# Altium schematic sheet HV_power.SchDoc
size A4; SheetNumber: 5; SheetTotal: 6
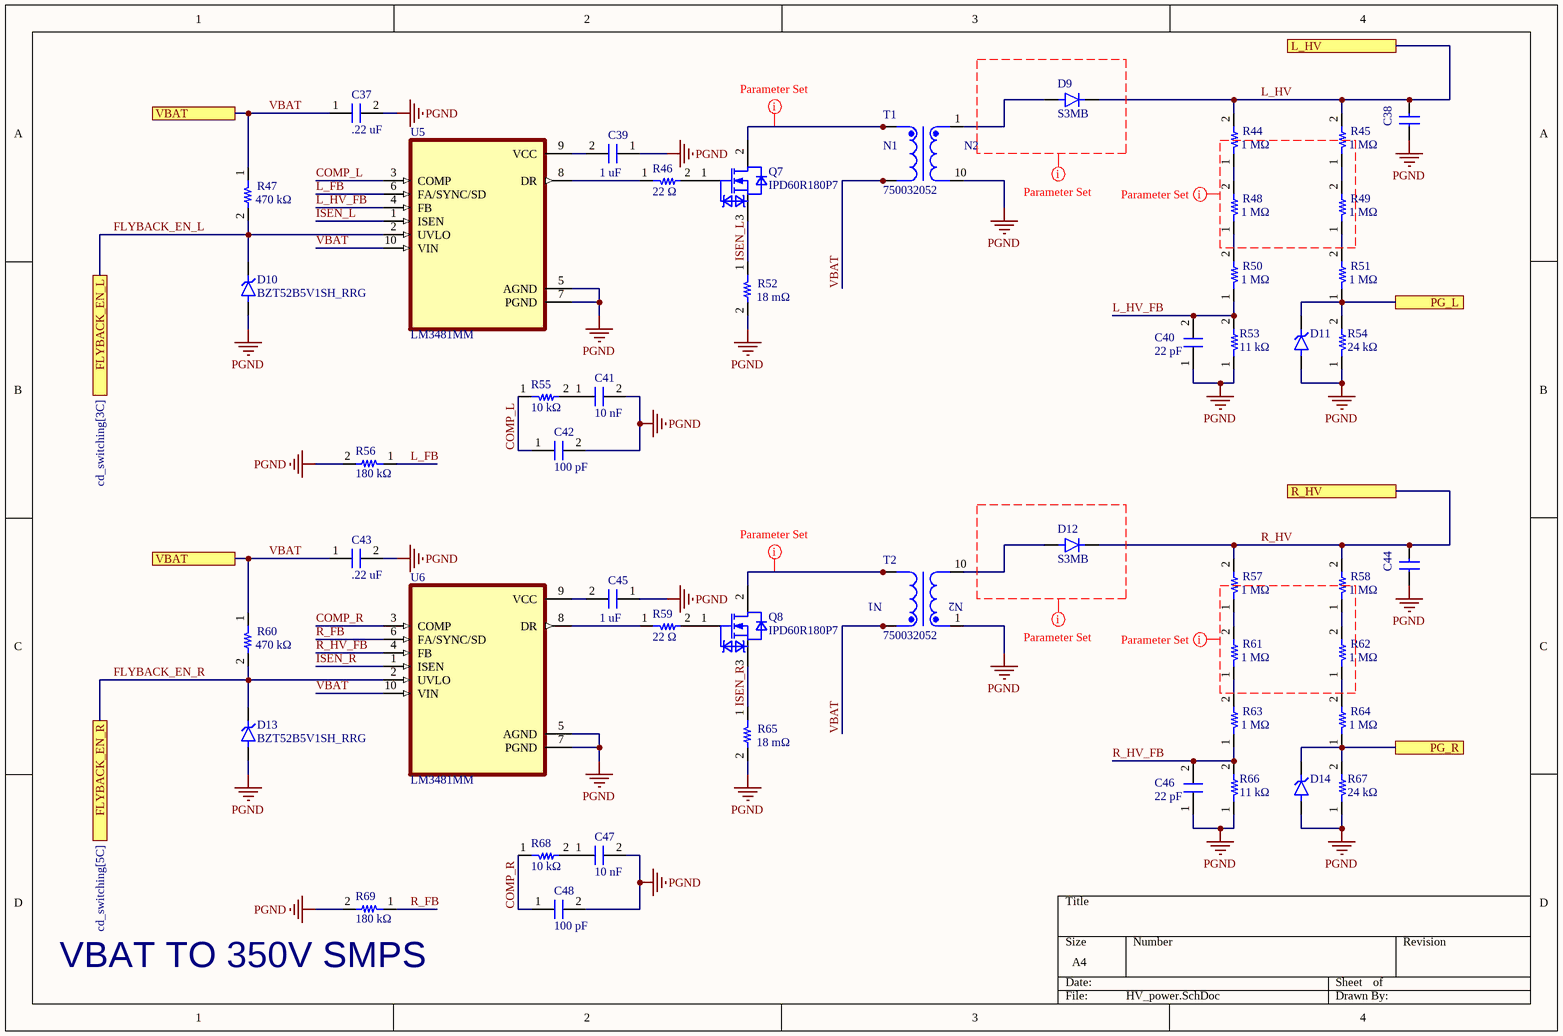
[diagram p0: HV_power.SchDoc]

## Parts
C37  value .22 uF  [0603_FP]  (hidden comment: GRM21BR61C475KA88L)
C38  WCAP-FTBP_P10  [WCAP-FTBP_10X13X5.5X11(PXLXWXH)]  (value not drawn)
C39  value 1 uF  [0603_FP]  (hidden comment: Capacitor_0603)
C40  value 22 pF  [0603_FP]  (hidden comment: Capacitor_0603)
C41  value 10 nF  [0603_FP]  (hidden comment: Capacitor_0603)
C42  value 100 pF  [0603_FP]  (hidden comment: Capacitor_0603)
C43  value .22 uF  [0603_FP]  (hidden comment: GRM21BR61C475KA88L)
C44  WCAP-FTBP_P10  [WCAP-FTBP_10X13X5.5X11(PXLXWXH)]  (value not drawn)
C45  value 1 uF  [0603_FP]  (hidden comment: Capacitor_0603)
C46  value 22 pF  [0603_FP]  (hidden comment: Capacitor_0603)
C47  value 10 nF  [0603_FP]  (hidden comment: Capacitor_0603)
C48  value 100 pF  [0603_FP]  (hidden comment: Capacitor_0603)
D9  S3MB  [DIOM4336X265N]
D10  BZT52B5V1SH_RRG  [DIO_BZT52B5V1SH_RRG]
D11  BZT52B15SH_RRG  [DIO_BZT52B15SH_RRG]  (value not drawn)
D12  S3MB  [DIOM4336X265N]
D13  BZT52B5V1SH_RRG  [DIO_BZT52B5V1SH_RRG]
D14  BZT52B15SH_RRG  [DIO_BZT52B15SH_RRG]  (value not drawn)
Q7  IPD60R180P7  [DPAK228P987X240-3N]
Q8  IPD60R180P7  [DPAK228P987X240-3N]
R44  value 1 MΩ  [0805_FP]  (hidden comment: R_0805)
R45  value 1 MΩ  [0805_FP]  (hidden comment: R_0805)
R46  value 22 Ω  [0603_FP]  (hidden comment: Resistor_0603)
R47  value 470 kΩ  [0603_FP]  (hidden comment: Resistor_0603)
R48  value 1 MΩ  [0805_FP]  (hidden comment: R_0805)
R49  value 1 MΩ  [0805_FP]  (hidden comment: R_0805)
R50  value 1 MΩ  [0805_FP]  (hidden comment: R_0805)
R51  value 1 MΩ  [0805_FP]  (hidden comment: R_0805)
R52  value 18 mΩ  [2010_FP]  (hidden comment: 2010_res)
R53  value 11 kΩ  [0805_FP]  (hidden comment: R_0805)
R54  value 24 kΩ  [0805_FP]  (hidden comment: R_0805)
R55  value 10 kΩ  [0603_FP]  (hidden comment: Resistor_0603)
R56  value 180 kΩ  [0603_FP]  (hidden comment: Resistor_0603)
R57  value 1 MΩ  [0805_FP]  (hidden comment: R_0805)
R58  value 1 MΩ  [0805_FP]  (hidden comment: R_0805)
R59  value 22 Ω  [0603_FP]  (hidden comment: Resistor_0603)
R60  value 470 kΩ  [0603_FP]  (hidden comment: Resistor_0603)
R61  value 1 MΩ  [0805_FP]  (hidden comment: R_0805)
R62  value 1 MΩ  [0805_FP]  (hidden comment: R_0805)
R63  value 1 MΩ  [0805_FP]  (hidden comment: R_0805)
R64  value 1 MΩ  [0805_FP]  (hidden comment: R_0805)
R65  value 18 mΩ  [2010_FP]  (hidden comment: 2010_res)
R66  value 11 kΩ  [0805_FP]  (hidden comment: R_0805)
R67  value 24 kΩ  [0805_FP]  (hidden comment: R_0805)
R68  value 10 kΩ  [0603_FP]  (hidden comment: Resistor_0603)
R69  value 180 kΩ  [0603_FP]  (hidden comment: Resistor_0603)
T1  750032052  [WE-FB3751_EFD20]
T2  750032052  [WE-FB3751_EFD20]
U5  LM3481MM  [SOP50P490X110-10N]
U6  LM3481MM  [SOP50P490X110-10N]

## Ports
FLYBACK_EN_L (see cd_switching[3C]), FLYBACK_EN_R (see cd_switching[5C]), L_HV (see cd_switching[4A]), PG_L (see logic[3B]), PG_R (see logic[3B]), R_HV (see cd_switching[6B]), VBAT (see cd_switching[3A], cd_switching[3B], HV_power[1A], input_output[2D], LV_power[1B]), VBAT (see cd_switching[3A], cd_switching[3B], HV_power[1C], input_output[2D], LV_power[1B])

## Nets
PGND: C37.2 C38.1 C39.1 C40.1 C41.2 C42.2 C43.2 C44.1 C45.1 C46.1 C47.2 C48.2 D10.2(A) D11.2(A) D13.2(A) D14.2(A) R52.2 R53.1 R54.1 R56.2 R65.2 R66.1 R67.1 R69.2 T1.10 T2.1 U5.5(AGND) U5.7(PGND) U6.5(AGND) U6.7(PGND)
COMP_L: C42.1 R55.1 U5.3(COMP)
COMP_R: C48.1 R68.1 U6.3(COMP)
FLYBACK_EN_L: D10.1(K) R47.2 U5.2(UVLO) ; port FLYBACK_EN_L
FLYBACK_EN_R: D13.1(K) R60.2 U6.2(UVLO) ; port FLYBACK_EN_R
ISEN_L: Q7.3(SOURCE) R52.1 U5.1(ISEN)
ISEN_R: Q8.3(SOURCE) R65.1 U6.1(ISEN)
L_FB: R56.1 U5.6(FA/SYNC/SD)
L_HV: C38.2 D9.C(K) R44.2 R45.2 ; port L_HV
L_HV_FB: C40.2 R50.1 R53.2 U5.4(FB)
PG_L: D11.1(K) R51.1 R54.2 ; port PG_L
PG_R: D14.1(K) R64.1 R67.2 ; port PG_R
R_FB: R69.1 U6.6(FA/SYNC/SD)
R_HV: C44.2 D12.C(K) R57.2 R58.2 ; port R_HV
R_HV_FB: C46.2 R63.1 R66.2 U6.4(FB)
VBAT: C37.1 C43.1 R47.1 R60.1 T1.4(4+5) T1.5(4+5) T2.6(6+7) T2.7(6+7) U5.10(VIN) U6.10(VIN) ; port VBAT
NetC39_2: C39.2 U5.9(VCC)
NetC41_1: C41.1 R55.2
NetC45_2: C45.2 U6.9(VCC)
NetC47_1: C47.1 R68.2
NetD9_A: D9.A T1.1
NetD12_A: D12.A T2.10
NetQ7_1: Q7.1(GATE) R46.2
NetQ7_2: Q7.2(DRAIN) T1.6(6+7) T1.7(6+7)
NetQ8_1: Q8.1(GATE) R59.2
NetQ8_2: Q8.2(DRAIN) T2.4(4+5) T2.5(4+5)
NetR44_1: R44.1 R48.2
NetR45_1: R45.1 R49.2
NetR46_1: R46.1 U5.8(DR)
NetR48_1: R48.1 R50.2
NetR49_1: R49.1 R51.2
NetR57_1: R57.1 R61.2
NetR58_1: R58.1 R62.2
NetR59_1: R59.1 U6.8(DR)
NetR61_1: R61.1 R63.2
NetR62_1: R62.1 R64.2

## Layout directives
net class HV_NETS: (no net found under the mark), NetQ7_2, NetQ8_2
net class FB_NETS: (no net found under the mark)

## Notes on the sheet
- (near R69) VBAT TO 350V SMPS
- (in symbol 750032052) N1; N2

## Library data of the parts
C37 C39-C43 C45-C48 = Capacitor_0603: Format: 0402; Package: 0402
C38 C44 = WCAP-FTBP_P10: MPPP010104J400DCPP55004; THT Boxed; 100 nF Â± 5 %; 400V (DC); RIso â‰¥ 30 GÎ©; pitch 10; Climate category 40/105/56; MF: Wurth Elektronik; MP: 890283323005CS; SnapEDA_Link: https://www.snapeda.com/parts/890283323005CS/Wurth+Electronics/view-part/?ref=snap; Package: None; Value: *; Check_prices: https://www.snapeda.com/parts/890283323005CS/Wurth+Electronics/view-part/?ref=eda
D9 D12 = S3MB: 3A, 1000V, Standard Recovery Rectifier; MF: Taiwan Semiconductor; SnapEDA_Link: https://www.snapeda.com/parts/S3MB/taiwan/view-part/?ref=snap; Package: SMD-2 Taiwan Semiconductor; Value: *; MP: S3MB; Check_prices: https://www.snapeda.com/parts/S3MB/taiwan/view-part/?ref=eda
D10 D13 = BZT52B5V1SH_RRG: SOD-323, 200mW, 2%, 5.1V, Zener Diode; MF: Taiwan Semiconductor Corporation; MP: BZT52B5V1SH RRG; SnapEDA_Link: https://www.snapeda.com/parts/BZT52B5V1SH%20RRG/Taiwan+Semiconductor+Corporation/view-part/?ref=snap; Package: SOD-323-2 Taiwan Semiconductor; Value: *; Check_prices: https://www.snapeda.com/parts/BZT52B5V1SH%20RRG/Taiwan+Semiconductor+Corporation/view-part/?ref=eda
D11 D14 = BZT52B15SH_RRG: SOD-323, 200mW, 2%, 15V, Zener Diode; MF: Taiwan Semiconductor Corporation; MP: BZT52B15SH RRG; SnapEDA_Link: https://www.snapeda.com/parts/BZT52B15SH%20RRG/Taiwan+Semiconductor+Corporation/view-part/?ref=snap; Package: SOD-323-2 Taiwan Semiconductor; Value: *; Check_prices: https://www.snapeda.com/parts/BZT52B15SH%20RRG/Taiwan+Semiconductor+Corporation/view-part/?ref=eda
Q7 Q8 = IPD60R180P7: Insulated-Gate Field-Effect Transistor (IGFET), N-Channel, Enhancement, Body Diode, ESD Diode Gate/Source, Pin 1 Gate, 2 Drain, 3 Source, 3 Pins; Manufacturer: Infineon Technologies; PackageReference: PG-TO252-3-342; Manufacturer Order Number: IPD60R180P7
R46 R47 R55 R56 R59 R60 R68 R69 = Resistor_0603: Format: 0402; Package: 0402
T1 T2 = 750032052: L= 10ÂµH, Turns ratio 10:1; Iprim=10A; suitable for LT3750; Vin = 3-24V typ.; Vout = variable 300V typ.; fswitch = 100-400kHz; MF: Wurth Electronics; SnapEDA_Link: https://www.snapeda.com/parts/750032052/Wurth+Electronics/view-part/?ref=snap; Package: None; Value: *; MP: 750032052; Check_prices: https://www.snapeda.com/parts/750032052/Wurth+Electronics/view-part/?ref=eda
U5 U6 = LM3481MM: 2.97V to 48V High-Efficiency Controller for Boost, SEPIC and Flyback; MF: Texas Instruments; MP: LM3481MM/NOPB; SnapEDA_Link: https://www.snapeda.com/parts/LM3481MM/NOPB/Texas+Instruments/view-part/?ref=snap; Package: VSSOP-10 Texas Instruments; Value: *; Check_prices: https://www.snapeda.com/parts/LM3481MM/NOPB/Texas+Instruments/view-part/?ref=eda